# EAGLE design ac_to_dc (EAGLE 6.1)
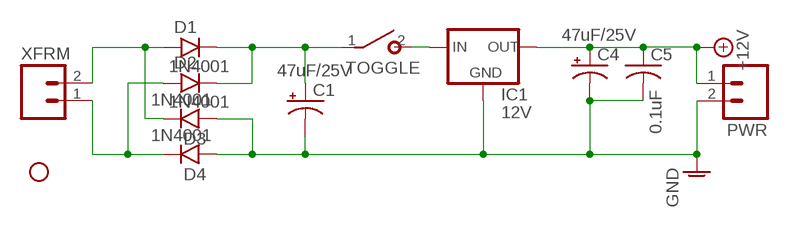
[diagram p0: schematic, sheet 1]

## Parts
C1  47uF/25V  CPOL-USE2.5-6  [E2,5-6]
C4  47uF/25V  CPOL-USE2.5-6  [E2,5-6]
C5  0.1uF  C-US025-025X050  [C025-025X050]
D1  1N4001  1N400X.3  [DO41-3]
D2  1N4001  1N400X.3  [DO41-3]
D3  1N4001  1N400X.3  [DO41-3]
D4  1N4001  1N400X.3  [DO41-3]
IC1  12V  78XXS  [78XXS]
JP1  STAND-OFF  [STAND-OFF]
PWR  M02PTH  [1X02]
TOGGLE  SPST  [SPST]
XFRM  M02PTH  [1X02]

## Nets
+12V: C4.+ C5.1 IC1.OUT PWR.1
AGND: C1.- C4.- C5.2 D3.A D4.A IC1.GND PWR.2 ; supply symbol labelled GND
N$1: IC1.IN TOGGLE.2(S)
N$2: D1.A D3.C XFRM.2
N$3: D2.A D4.C XFRM.1
N$9: C1.+ D1.C D2.C TOGGLE.1(P)

## Library data of the parts
C1 C4 = minimidi:CPOL-US: POLARIZED CAPACITOR, American symbol
C5 = minimidi:C-US: CAPACITOR, American symbol
D1-D4 = gm-diodes:1N400X: Rectifier Diodes often used in power supply to prevent damage from reverse polarization
IC1 = v-reg:78XXS: VOLTAGE REGULATOR
JP1 = SparkFun:STAND-OFF: Stand Off This is the mechanical footprint for a #4 phillips button head screw. Use the keepout ring to avoid running the screw head into surrounding components. SKU : PRT-00447
PWR XFRM = SparkFun:M02: Header 2 Standard 2-pin 0.1" header. Use with straight break away headers (SKU : PRT-00116), right angle break away headers (PRT-00553), swiss pins (PRT-00743), machine pins (PRT-00117), and female headers (PRT-00115). Molex polarized connector foot print use with SKU : PRT-08233 with associated crimp pins and housings.
TOGGLE = gm-switches:SPST

## Net classes
1 power: width 0.61 mm

## Board
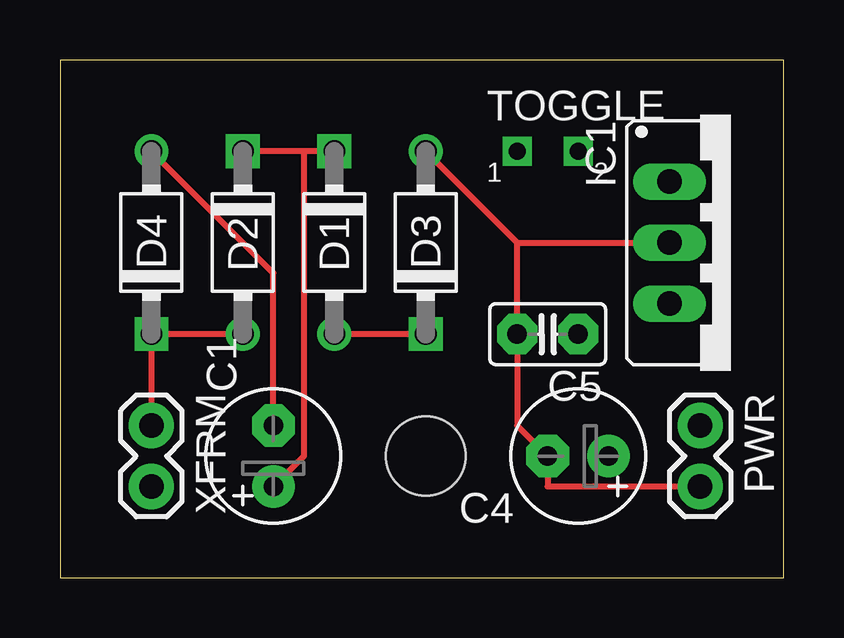
[diagram p1: board, top side]
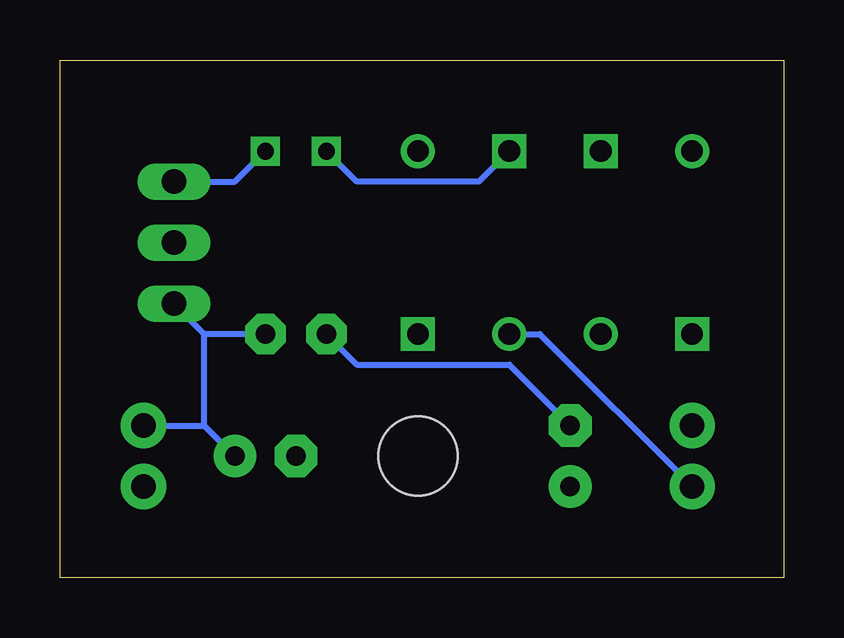
[diagram p2: board, bottom side, seen from below]

Size 30.15 x 21.58 mm. Coordinates in mm from the lower left corner, seen from the top.
Outline: 0,0 30.15,0 30.15,21.58 0,21.58 0,0
Copper layers (1*16): Top 0.035mm / dielectric 1.5mm / Bottom 0.035mm
Design rules: minimum track width 10mil, minimum drill 24mil, track to track 8mil, track to pad 8mil, pad to pad 8mil, via to via 8mil, smd to smd 8mil, copper to edge 40mil, drill to drill 8mil, minimum pad ring 10mil, minimum via ring 8mil, stop-mask expansion 4mil, vias tented up to drill 0mil, thermal gap 10mil

### Footprints (pad centres in the part's own frame; a part is rotated, then mirrored left to right if it is on the bottom)
E2,5-6 = drill 0.813 pad 1.778: + -1.27,0 | drill 0.813 pad 1.778 octagon: - 1.27,0
C025-025X050 = drill 0.813 pad 1.676 octagon: 1 -1.27,0; 2 1.27,0
DO41-3 = drill 0.9: A 3.81,0 | drill 0.9 square: C -3.81,0
78XXS = drill 1.016 long: GND 0,-2.54; IN -2.54,-2.54; OUT 2.54,-2.54
STAND-OFF = hole 3.302: 0,0
1X02 = drill 1.016 pad 1.88: 1 0,0; 2 2.54,0
SPST = drill 0.7 square: 1 -1.27,0; 2 1.27,0

### Placement (x,y rotation side)
C1  8.89,5.08 90 top
C4  21.59,5.08 180 top
C5  20.32,10.16 180 top
D1  11.43,13.97 270 top
D2  7.62,13.97 270 top
D3  15.24,13.97 90 top
D4  3.81,13.97 90 top
IC1  27.94,13.97 270 top
JP1  15.24,5.08 0 top
PWR  26.67,6.35 270 top
TOGGLE  20.32,17.78 0 top
XFRM  3.81,6.35 270 top

### Tracks (layer width: path | path; a pad name or v marks a point on that pad's centre or on a via)
+12V
  Bottom 0.254: 24.13,10.16 IC1.OUT | C5.1 24.13,10.16 | 24.13,6.35 C4.+ | PWR.1 24.13,6.35 | 24.13,6.35 24.13,10.16
AGND
  Top 0.254: D4.A 8.89,12.7 C1.- | 19.05,13.97 D3.A | 19.05,13.97 C5.2 19.05,6.35 C4.- 20.32,3.81 PWR.2 | 19.05,13.97 IC1.GND
  Bottom 0.254: C1.- 11.43,8.89 17.78,8.89 C5.2
N$1
  Bottom 0.254: TOGGLE.2 22.86,16.51 IC1.IN
N$2
  Top 0.254: D3.C D1.A
  Bottom 0.254: XFRM.2 10.16,10.16 D1.A
N$3
  Top 0.254: D2.A D4.C XFRM.1
N$9
  Top 0.254: D1.C 10.16,17.78 | 10.16,17.78 D2.C | C1.+ 10.16,5.08 10.16,17.78
  Bottom 0.254: TOGGLE.1 17.78,16.51 12.7,16.51 D1.C